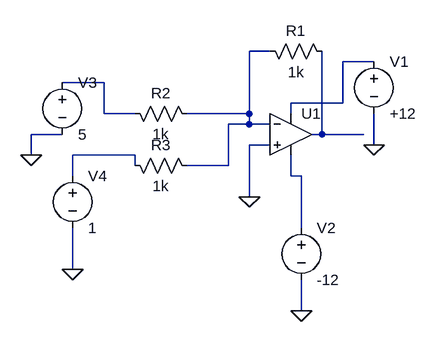
[diagram p0: schematic Inverting Adder DC.asc]
Inverting Adder DC.asc, the LTspice schematic file:
Version 4
SHEET 1 880 680
WIRE 160 48 128 48
WIRE 320 64 272 64
WIRE -96 96 -160 96
WIRE 272 128 272 64
WIRE 272 128 192 128
WIRE -96 144 -96 96
WIRE -48 144 -96 144
WIRE 128 144 128 48
WIRE 128 144 32 144
WIRE 192 144 192 128
WIRE 128 160 128 144
WIRE 128 160 96 160
WIRE 160 160 128 160
WIRE -160 176 -208 176
WIRE 240 176 240 48
WIRE 240 176 224 176
WIRE 304 176 240 176
WIRE 160 192 128 192
WIRE 320 192 320 144
WIRE -208 208 -208 176
WIRE -48 208 -144 208
WIRE -48 224 -48 208
WIRE 96 224 96 160
WIRE 96 224 32 224
WIRE -144 240 -144 208
WIRE 192 240 192 208
WIRE 208 240 192 240
WIRE 128 272 128 192
WIRE 208 320 208 240
WIRE -144 384 -144 320
WIRE 208 448 208 400
FLAG 128 272 0
FLAG 320 192 0
FLAG 208 448 0
FLAG -208 208 0
FLAG -144 384 0
SYMBOL Opamps\\UniversalOpamp2 192 176 R0
SYMATTR InstName U1
SYMBOL res 144 32 M90
WINDOW 0 0 56 VBottom 2
WINDOW 3 32 56 VTop 2
SYMATTR InstName R1
SYMATTR Value 1k
SYMBOL res -64 128 M90
WINDOW 0 0 56 VBottom 2
WINDOW 3 32 56 VTop 2
SYMATTR InstName R2
SYMATTR Value 1k
SYMBOL res -64 208 M90
WINDOW 0 0 56 VBottom 2
WINDOW 3 32 56 VTop 2
SYMATTR InstName R3
SYMATTR Value 1k
SYMBOL voltage 320 48 R0
SYMATTR InstName V1
SYMATTR Value +12
SYMBOL voltage 208 304 R0
SYMATTR InstName V2
SYMATTR Value -12
SYMBOL voltage -160 80 R0
SYMATTR InstName V3
SYMATTR Value 5
SYMBOL voltage -144 224 R0
SYMATTR InstName V4
SYMATTR Value 1

The netlist it stands for:
* Inverting Adder DC.asc
XU1 0 N001 N002 N006 N004 level.2 Avol=1Meg GBW=10Meg Slew=10Meg ilimit=25m rail=0 Vos=0 phimargin=45 en=0 enk=0 in=0 ink=0 Rin=500Meg  ; pins IN+ IN- V+ V- OUT
R1 N001 N004 1k
R2 N003 N001 1k
R3 N005 N001 1k
V1 N002 0 +12
V2 N006 0 -12
V3 N003 0 5
V4 N005 0 1
.lib UniversalOpamps2.sub
.backanno
.end